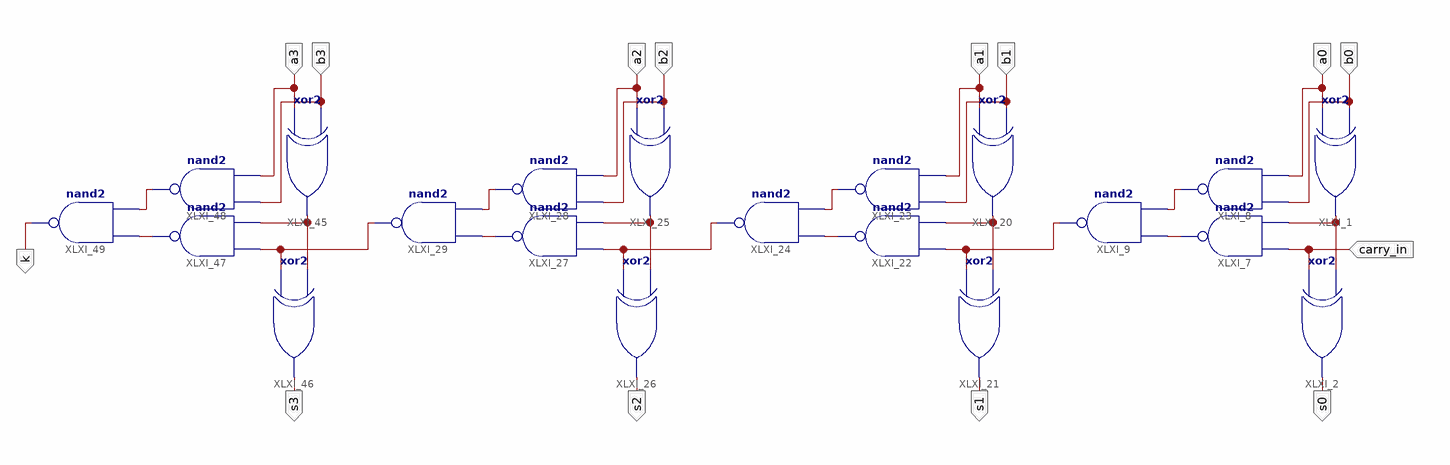
[diagram p0: schematic sheet 1]
// Xilinx ISE schematic lab7rippleadder.sch (xa9500xl) as structural Verilog: 20 symbols, 14 ports
module lab7rippleadder (
  input  carry_in,
  input  a0,
  input  b0,
  input  a1,
  input  b1,
  input  a2,
  input  b2,
  input  a3,
  input  b3,
  output k,
  output s0,
  output s1,
  output s2,
  output s3
);

  wire XLXN_29, XLXN_30, XLXN_56, XLXN_89, XLXN_90, XLXN_91, XLXN_93, XLXN_97, XLXN_98, XLXN_99, XLXN_101,
       XLXN_129, XLXN_130, XLXN_131, XLXN_133;

  xor XLXI_1 (XLXN_56, a0, b0);
  xor XLXI_2 (s0, carry_in, XLXN_56);
  nand XLXI_7 (XLXN_30, XLXN_56, carry_in);
  nand XLXI_8 (XLXN_29, a0, b0);
  nand XLXI_9 (XLXN_90, XLXN_29, XLXN_30);
  xor XLXI_20 (XLXN_89, a1, b1);
  xor XLXI_21 (s1, XLXN_90, XLXN_89);
  nand XLXI_22 (XLXN_91, XLXN_89, XLXN_90);
  nand XLXI_23 (XLXN_93, a1, b1);
  nand XLXI_24 (XLXN_98, XLXN_93, XLXN_91);
  xor XLXI_25 (XLXN_97, a2, b2);
  xor XLXI_26 (s2, XLXN_98, XLXN_97);
  nand XLXI_27 (XLXN_99, XLXN_97, XLXN_98);
  nand XLXI_28 (XLXN_101, a2, b2);
  nand XLXI_29 (XLXN_130, XLXN_101, XLXN_99);
  xor XLXI_45 (XLXN_129, a3, b3);
  xor XLXI_46 (s3, XLXN_130, XLXN_129);
  nand XLXI_47 (XLXN_131, XLXN_129, XLXN_130);
  nand XLXI_48 (XLXN_133, a3, b3);
  nand XLXI_49 (k, XLXN_133, XLXN_131);
endmodule
